# Altium schematic sheet PowerBoardConnector.SchDoc: Title
size A4; SchTemplateVer: V2.0; Author: Adam Mizerkiewicz; CompanyName: Adam Mizerkiewicz; DrawnBy: Adam Mizerkiewicz; Engineer: Adam Mizerkiewicz; Organization: Adam Mizerkiewicz; Address1: Sarnia 2/19; Address2: 61-058 Poznań; Revision: 0.0; SheetNumber: 17; SheetTotal: 17
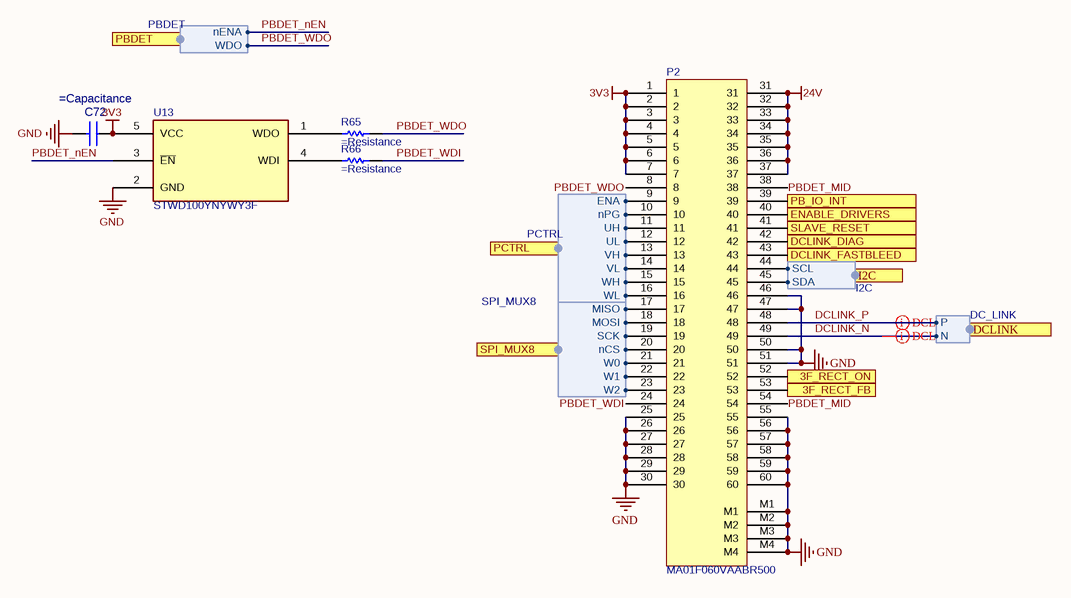
[diagram p0: PowerBoardConnector.SchDoc]

## Parts
C72  (no value)  [C0402]
P2  MA01F060VAABR500  [MA01F060VAABR500]
R65  (no value)  [R0402]
R66  (no value)  [R0402]
U13  STWD100YNYWY3F  [SOT-23-5]

## Ports
3F_RECT_FB (out), 3F_RECT_ON (in), DCLINK (harness DC_LINK), DCLINK_DIAG (out), DCLINK_FASTBLEED (in), ENABLE_DRIVERS (in), I2C (harness I2C), PB_IO_INT (out), PBDET (harness PBDET), PCTRL (harness PCTRL), SLAVE_RESET (in), SPI_MUX8 (harness SPI_MUX8)

## Harnesses
SPI_MUX8: nCS, SCK, MISO, MOSI, W0, W1, W2
PCTRL: UH, UL, VH, VL, WH, WL, ENA, nPG
I2C: SDA, SCL
PBDET: WDO, nENA
DC_LINK: N, P

## Nets
3V3: C72.1 P2.1 P2.2 P2.3 P2.4 P2.5 P2.6 P2.7 U13.5(VCC)
24V: P2.31 P2.32 P2.33 P2.34 P2.35 P2.36 P2.37
GND: C72.2 P2.25 P2.26 P2.27 P2.28 P2.29 P2.30 P2.46 P2.47 P2.50 P2.51 P2.55 P2.56 P2.57 P2.58 P2.59 P2.60 P2.M1 P2.M2 P2.M3 P2.M4 U13.2(GND)
3F_RECT_FB: P2.53 ; port 3F_RECT_FB
3F_RECT_ON: P2.52 ; port 3F_RECT_ON
DCLINK_DIAG: P2.42 ; port DCLINK_DIAG
DCLINK_FASTBLEED: P2.43 ; port DCLINK_FASTBLEED
DCLINK_N: P2.49 ; port DCLINK.N
DCLINK_P: P2.48 ; port DCLINK.P
ENABLE_DRIVERS: P2.40 ; port ENABLE_DRIVERS
PB_IO_INT: P2.39 ; port PB_IO_INT
PBDET_MID: P2.38 P2.54
PBDET_nEN: U13.3(~{EN}) ; port PBDET.nENA
PBDET_WDI: P2.24 R66.2
PBDET_WDO: P2.8 R65.2 ; port PBDET.WDO
SLAVE_RESET: P2.41 ; port SLAVE_RESET
NetP2_9: P2.9 ; port PCTRL.ENA
NetP2_10: P2.10 ; port PCTRL.nPG
NetP2_11: P2.11 ; port PCTRL.UH
NetP2_12: P2.12 ; port PCTRL.UL
NetP2_13: P2.13 ; port PCTRL.VH
NetP2_14: P2.14 ; port PCTRL.VL
NetP2_15: P2.15 ; port PCTRL.WH
NetP2_16: P2.16 ; port PCTRL.WL
NetP2_17: P2.17 ; port SPI_MUX8.MISO
NetP2_18: P2.18 ; port SPI_MUX8.MOSI
NetP2_19: P2.19 ; port SPI_MUX8.SCK
NetP2_20: P2.20 ; port SPI_MUX8.nCS
NetP2_21: P2.21 ; port SPI_MUX8.W0
NetP2_22: P2.22 ; port SPI_MUX8.W1
NetP2_23: P2.23 ; port SPI_MUX8.W2
NetP2_44: P2.44 ; port I2C.SCL
NetP2_45: P2.45 ; port I2C.SDA
NetR65_1: R65.1 U13.1(WDO)
NetR66_1: R66.1 U13.4(WDI)

## Layout directives
differential pair; differential pair class AnalogDiff: DCLINK_N, DCLINK_P

## Notes on the sheet
- Revision
  =Revision
- Sheet
  =SheetNumber / =SheetTotal

## Library data of the parts
C72 = CAP0402-0.1uF-50V: CAP CER 0.1UF 50V X7R 0402; Manufacturer: Walsin Technologies; Manufacturer Part Number: 0402B104K500CT; Capacitance: 100nF; Material: 4241ConductorMaterial; Value: 100nF; Tolerance: 10%; Dielectric: 1511DielectricType; Supplier: Digikey; Supplier Part Number: 1292-1176-1-ND; RoHS: Yes; Category: Ceramic Capacitors; Stock: 109567; Pricing: 1=0,08, 10=0,005, 100=0,0032, 1000=0,0024 (USD); Mounting Technology: Surface Mount; Case/Package: 0402; Case Code (Imperial): 0402; Case Code (Metric): 1005; Min Operating Temperature: -55°C; Max Operating Temperature: 125°C; Packaging: Cut Tape; Voltage Rating: 50V; Series: -; Voltage Rating (DC): 50V; Height: 550um; RoHS Compliant: Yes; Lead Free: 5697LeadFree; ComponentLink1URL: http://datasheet.octopart.com/0402B104K500CT-Walsin-Technologies-datasheet-26371553.pdf?src-supplier=Arrow+Electronics; ComponentLink1Description: http://datasheet.octopart.com/0402B104K500CT-Walsin-Technologies-datasheet-26371553.pdf?src-supplier=Arrow+Electronics; ComponentLink2URL: http://datasheet.octopart.com/0402B104K500CT-Walsin-Technologies-datasheet-26371553.pdf?src-supplier=Verical; ComponentLink2Description: http://datasheet.octopart.com/0402B104K500CT-Walsin-Technologies-datasheet-26371553.pdf?src-supplier=Verical; ComponentLink3URL: http://www.passivecomponent.com/indexsea/0402B104K500CT-IE.pdf?src-supplier=Digikey; ComponentLink3Description: http://www.passivecomponent.com/indexsea/0402B104K500CT-IE.pdf?src-supplier=Digikey; ComponentLink4URL: http://datasheet.octopart.com/0402B104K500CT-Walsin-Technologies-datasheet-26371553.pdf?src-supplier=Rs; ComponentLink4Description: http://datasheet.octopart.com/0402B104K500CT-Walsin-Technologies-datasheet-26371553.pdf?src-supplier=Rs; ComponentLink5URL: https://datasheet.octopart.com/0402B104K500CT-Walsin-Technologies-datasheet-128065749.pdf?src-supplier=Future+Electronics; ComponentLink5Description: https://datasheet.octopart.com/0402B104K500CT-Walsin-Technologies-datasheet-128065749.pdf?src-supplier=Future+Electronics; ComponentLink6URL: http://datasheet.octopart.com/0402B104K500CT-Walsin-Technologies-datasheet-26371553.pdf?src-supplier=Farnell; ComponentLink6Description: http://datasheet.octopart.com/0402B104K500CT-Walsin-Technologies-datasheet-26371553.pdf?src-supplier=Farnell; ComponentLink7URL: http://datasheet.octopart.com/0402B104K500CT-Walsin-Technologies-datasheet-26371553.pdf?src-supplier=Newark; ComponentLink7Description: http://datasheet.octopart.com/0402B104K500CT-Walsin-Technologies-datasheet-26371553.pdf?src-supplier=Newark; ComponentLink8URL: http://datasheet.octopart.com/0402B104K500CT-Walsin-Technologies-datasheet-26371553.pdf?src-supplier=Mouser; ComponentLink8Description: http://datasheet.octopart.com/0402B104K500CT-Walsin-Technologies-datasheet-26371553.pdf?src-supplier=Mouser; ComponentLink9URL: http://datasheet.octopart.com/0402B104K500CT-Walsin-Technologies-datasheet-26371553.pdf?src-supplier=Digikey; ComponentLink9Description: http://datasheet.octopart.com/0402B104K500CT-Walsin-Technologies-datasheet-26371553.pdf?src-supplier=Digikey; ComponentLink10URL: https://datasheet.octopart.com/0402B104K500CT-Walsin-Technologies-datasheet-62066062.pdf?src-supplier=TME; ComponentLink10Description: https://datasheet.octopart.com/0402B104K500CT-Walsin-Technologies-datasheet-62066062.pdf?src-supplier=TME; ComponentLink11URL: http://datasheet.octopart.com/0402B104K500CT-Walsin-Technologies-datasheet-26371553.pdf?src-supplier=Freelance+Electronics; ComponentLink11Description: http://datasheet.octopart.com/0402B104K500CT-Walsin-Technologies-datasheet-26371553.pdf?src-supplier=Freelance+Electronics; ComponentLink12URL: http://datasheet.octopart.com/0402B104K500CT-Walsin-Technologies-datasheet-26371553.pdf?src-supplier=Component+Sense; ComponentLink12Description: http://datasheet.octopart.com/0402B104K500CT-Walsin-Technologies-datasheet-26371553.pdf?src-supplier=Component+Sense; ComponentLink13URL: http://datasheet.octopart.com/0402B104K500CT-Walsin-Technologies-datasheet-26371553.pdf?src-supplier=NAC+Semi; ComponentLink13Description: http://datasheet.octopart.com/0402B104K500CT-Walsin-Technologies-datasheet-26371553.pdf?src-supplier=NAC+Semi; ComponentLink14URL: https://datasheet.octopart.com/0402B104K500CT-Walsin-Technologies-datasheet-136037192.pdf?src-supplier=TECHDesign; ComponentLink14Description: https://datasheet.octopart.com/0402B104K500CT-Walsin-Technologies-datasheet-136037192.pdf?src-supplier=TECHDesign; Supplier 1: Digikey; Supplier Part Number 1: 1292-1176-1-ND
R65 R66 = RES0402-1k-1%: Res Thick Film 0402 1K Ohm 1% 0.063W(1/16W) ±50ppm/C Pad SMD Automotive T/R; Manufacturer: Vishay; Manufacturer Part Number: CRCW04021K00FHEDP; Resistance: 1kΩ; Max Power Dissipation: 63mW; Value: 1kΩ; Temperature Coefficient: 50ppm/°C; Voltage Rating: 50V; Supplier 1: DigiKey; Supplier Part Number 1: CRCW04021K00FHEDP-ND; Supplier: DigiKey; Supplier Part Number: CRCW04021K00FHEDP-ND; RoHS: Compliant; Category: Chip SMD Resistors; Pricing: 10000=0,03252 (USD); Case/Package: 0402; China RoHS: Non-Compliant; Composition: Thick Film; Contact Plating: Tin; Depth: 500µm; Features: Automotive AEC-Q200; Height: 350µm; Length: 990.6µm; Lifecycle Status: Production; Max Operating Temperature: 155°C; Military Standard: Not; Min Operating Temperature: -55°C; Mounting Technology: Surface Mount; Number of Terminals: 2; Number of Terminations: 2; Packaging: Tape & Reel; Power Dissipation: 63mW; Power Rating: 63mW; Radiation Hardening: No; REACH SVHC: Yes; Tolerance: 1%; Width: 500µm; Working Voltage: 50V; ComponentLink1URL: https://datasheet.octopart.com:443/CRCW04021K00FHEDP-Vishay-datasheet-182027415.pdf?src-supplier=IHS; ComponentLink1Description: https://datasheet.octopart.com:443/CRCW04021K00FHEDP-Vishay-datasheet-182027415.pdf?src-supplier=IHS; ComponentLink2URL: https://datasheet.octopart.com:443/CRCW04021K00FHEDP-Vishay-Dale-datasheet-141207190.pdf?src-supplier=Upverter; ComponentLink2Description: https://datasheet.octopart.com:443/CRCW04021K00FHEDP-Vishay-Dale-datasheet-141207190.pdf?src-supplier=Upverter; ComponentLink3URL: http://sigma.octopart.com:80/rohs_statement/Vishay-company-15.pdf?src-supplier=Compliance+Statements; ComponentLink3Description: http://sigma.octopart.com:80/rohs_statement/Vishay-company-15.pdf?src-supplier=Compliance+Statements
U13 = STWD100YNYWY3F: Processor Supervisor 1 Open Drain/Push-Pull Automotive AEC-Q100 5-Pin SOT-23 T/R; Manufacturer: STMicroelectronics; Max Power Dissipation: 320mW; Max Supply Current: 26µA; Max Supply Voltage: 5.5V; Min Supply Voltage: 2.7V; Nominal Supply Current: 13µA; Number of Channels: 1; Operating Supply Voltage: 5V; Reset: Active Low; Reset Timeout: 1.6s; Supplier 1: DigiKey; Supplier Part Number 1: 497-14411-1-ND; Supplier: DigiKey; Supplier Part Number: 497-14411-1-ND; Manufacturer Part Number: STWD100YNYWY3F; RoHS: Compliant; Category: Voltage Supervisors; Stock: 2415; Pricing: 1=1,09, 10=0,785, 25=0,7096, 100=0,6263, 250=0,58648, 500=0,56252, 1000=0,54278 (USD); Ambient Temperature Range High: 125°C; Case/Package: SOT-23-5; China RoHS: Compliant; Contact Plating: Gold; Height: 1.45mm; Height - Seated (Max): 1.45mm; Lead Free: Lead Free; Length: 2.9mm; Lifecycle Status: Production; Max Operating Temperature: 125°C; Min Operating Temperature: -40°C; Mounting Technology: Surface Mount; Number of Circuits: 1; Number of Monitored Inputs: 1; Number of Outputs: 1; Pins: 5; Number of Terminals: 5; Number of Voltages Monitored: 1; Operating Supply Current: 13µA; Radiation Hardening: No; REACH SVHC: Yes; Schedule B: 8542390000, 8542390000|8542390000|8542390000|8542390000|8542390000; Terminal Pitch: 950µm; Type: Watchdog Circuit; Width: 1.6mm; ComponentLink1URL: https://datasheet.octopart.com:443/STWD100YNYWY3F-STMicroelectronics-datasheet-62069531.pdf?src-supplier=STMicroelectronics; ComponentLink1Description: https://datasheet.octopart.com:443/STWD100YNYWY3F-STMicroelectronics-datasheet-62069531.pdf?src-supplier=STMicroelectronics; ComponentLink2URL: https://datasheet.octopart.com:443/STWD100YNYWY3F-STMicroelectronics-datasheet-11766130.pdf?src-supplier=Future+Electronics; ComponentLink2Description: https://datasheet.octopart.com:443/STWD100YNYWY3F-STMicroelectronics-datasheet-11766130.pdf?src-supplier=Future+Electronics; ComponentLink3URL: https://datasheet.octopart.com:443/STWD100YNYWY3F-STMicroelectronics-datasheet-77992484.pdf?src-supplier=element14+APAC; ComponentLink3Description: https://datasheet.octopart.com:443/STWD100YNYWY3F-STMicroelectronics-datasheet-77992484.pdf?src-supplier=element14+APAC; ComponentLink4URL: https://datasheet.octopart.com:443/STWD100YNYWY3F-STMicroelectronics-datasheet-159009383.pdf?src-supplier=SHENGYU+ELECTRONICS; ComponentLink4Description: https://datasheet.octopart.com:443/STWD100YNYWY3F-STMicroelectronics-datasheet-159009383.pdf?src-supplier=SHENGYU+ELECTRONICS